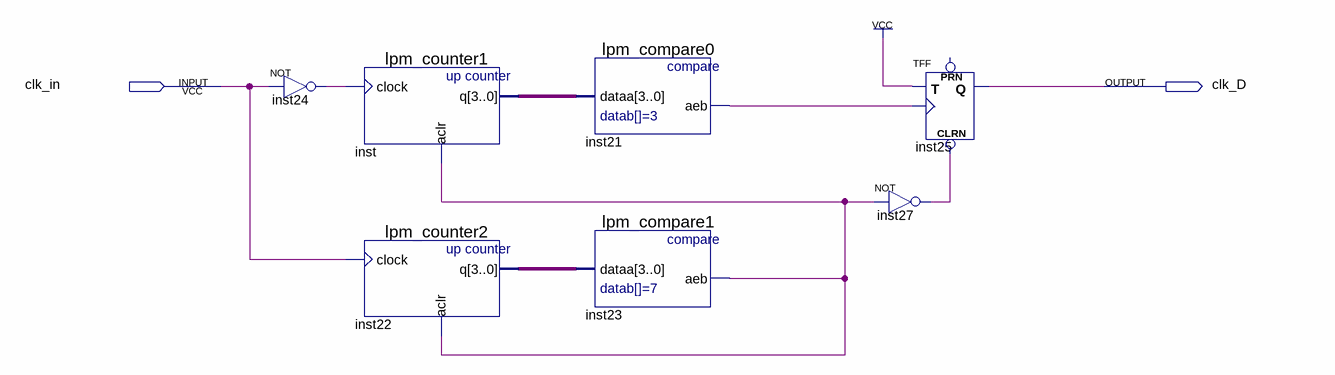
[diagram p0: schematic sheet]
// Quartus schematic block2.bdf as structural Verilog: 7 symbols, 2 pins
module block2 (
  input  clk_in,
  output clk_D
);

  wire inst21_aeb, inst23_aeb, inst24_out, inst27_out;
  wire [3:0] inst22_q, inst_q;

  not inst24 (inst24_out, clk_in);
  lpm_counter1 inst (.clock(inst24_out), .aclr(inst23_aeb), .q(inst_q));
  lpm_counter2 inst22 (.clock(clk_in), .aclr(inst23_aeb), .q(inst22_q));
  lpm_compare0 inst21 (.dataa(inst_q), .aeb(inst21_aeb));
  lpm_compare1 inst23 (.dataa(inst22_q), .aeb(inst23_aeb));
  not inst27 (inst27_out, inst23_aeb);
  TFF inst25 (.CLRN(inst27_out), .T(1'b1), .CLK(inst21_aeb), .Q(clk_D));  // open: PRN
endmodule
